# EAGLE design wordclock-r1 (EAGLE 4.16)
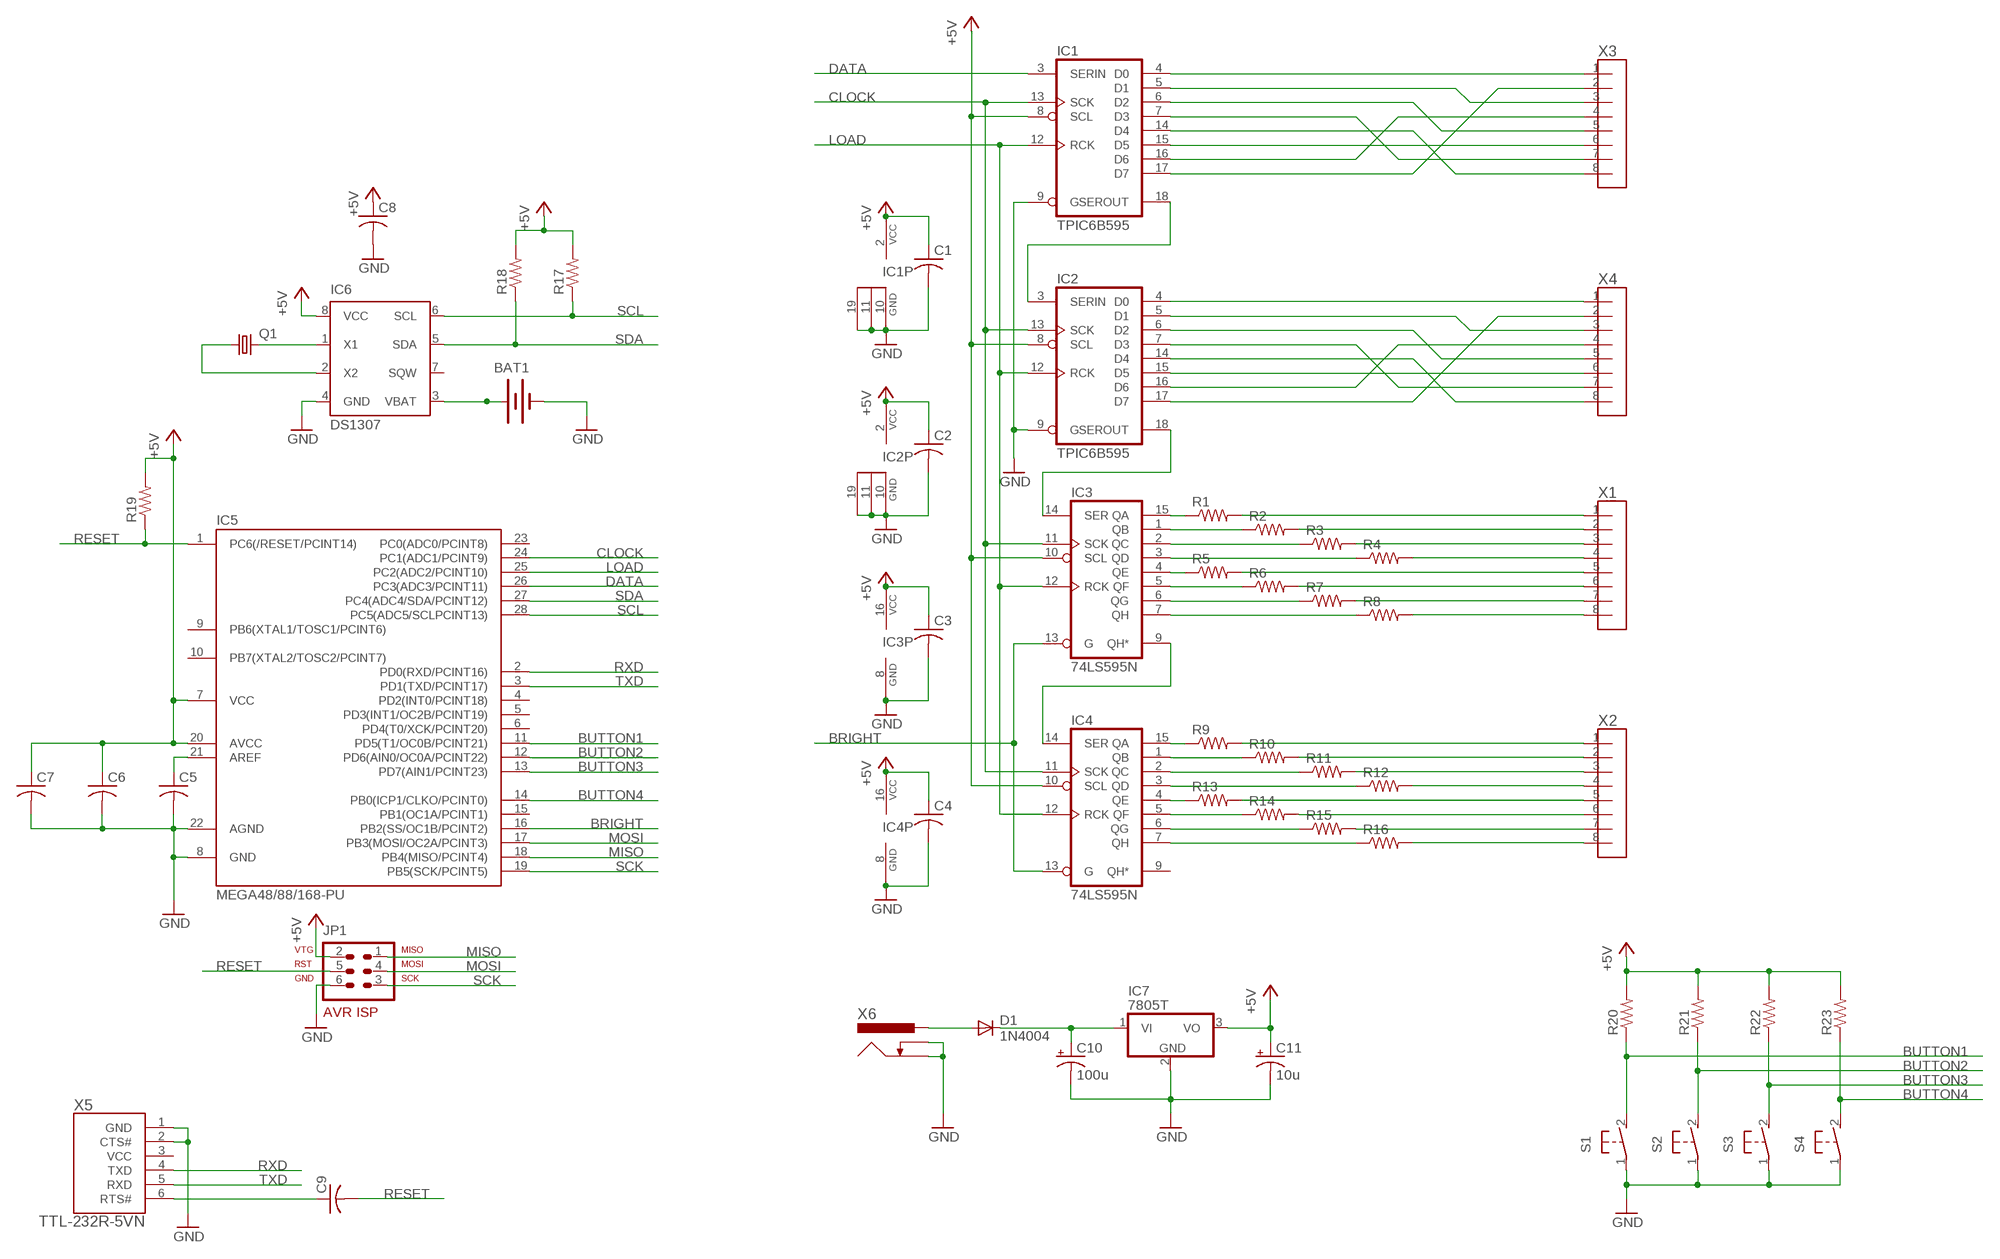
[diagram p0: schematic, sheet 1]

## Parts
BAT1  BATTERY12MM  [BATTCON_12MM]
C1  C-US050-025X075  [C050-025X075]
C2  C-US050-025X075  [C050-025X075]
C3  C-US050-025X075  [C050-025X075]
C4  C-US050-025X075  [C050-025X075]
C5  C-US050-025X075  [C050-025X075]
C6  C-US050-025X075  [C050-025X075]
C7  C-US050-025X075  [C050-025X075]
C8  C-US050-025X075  [C050-025X075]
C9  C-US050-025X075  [C050-025X075]
C10  100u  CPOL-USE3.5-8  [E3,5-8]
C11  10u  CPOL-USE2.5-6  [E2,5-6]
D1  1N4004  [DO41-10]
IC1  TPIC6B595  [DIL20]
IC2  TPIC6B595  [DIL20]
IC3  74LS595N  [DIL16]
IC4  74LS595N  [DIL16]
IC5  MEGA48/88/168-PU  [DIL28-3]
IC6  DS1307  [DIL08]
IC7  7805T  [TO220H]
JP1  AVR-ISP-6  [AVR-ISP-6]
Q1  CRYSTALTC38H  [TC38H]
R1  R-US_0207/2V  [0207/2V]
R2  R-US_0207/2V  [0207/2V]
R3  R-US_0207/2V  [0207/2V]
R4  R-US_0207/2V  [0207/2V]
R5  R-US_0207/2V  [0207/2V]
R6  R-US_0207/2V  [0207/2V]
R7  R-US_0207/2V  [0207/2V]
R8  R-US_0207/2V  [0207/2V]
R9  R-US_0207/2V  [0207/2V]
R10  R-US_0207/2V  [0207/2V]
R11  R-US_0207/2V  [0207/2V]
R12  R-US_0207/2V  [0207/2V]
R13  R-US_0207/2V  [0207/2V]
R14  R-US_0207/2V  [0207/2V]
R15  R-US_0207/2V  [0207/2V]
R16  R-US_0207/2V  [0207/2V]
R17  R-US_0207/10  [0207/10]
R18  R-US_0207/10  [0207/10]
R19  R-US_0207/10  [0207/10]
R20  R-US_0207/10  [0207/10]
R21  R-US_0207/10  [0207/10]
R22  R-US_0207/10  [0207/10]
R23  R-US_0207/10  [0207/10]
S1  31-XX  [B3F-31XX]
S2  31-XX  [B3F-31XX]
S3  31-XX  [B3F-31XX]
S4  31-XX  [B3F-31XX]
X1  M08-100MIL  [100MIL-8]
X2  M08-100MIL  [100MIL-8]
X3  M08-100MIL  [100MIL-8]
X4  M08-100MIL  [100MIL-8]
X5  TTL-232R-5VN  [USBCABLE-0.100-NOLBL]
X6  PJ-002B  [PJ-002]

## Nets
+5V: C1.1 C2.1 C3.1 C4.1 C6.1 C7.1 C8.1 C11.+ IC1.2(VCC) IC1.8(SCL) IC2.2(VCC) IC2.8(SCL) IC3.10(SCL) IC3.16(VCC) IC4.10(SCL) IC4.16(VCC) IC5.7(VCC) IC5.20(AVCC) IC6.8(VCC) IC7.3(VO) JP1.2 R17.2 R18.2 R19.2 R20.2 R21.2 R22.2 R23.2
BRIGHT: IC3.13(G) IC4.13(G) IC5.16(PB2(SS/OC1B/PCINT2))
BUTTON1: IC5.11(PD5(T1/OC0B/PCINT21)) R20.1 S1.2(S)
BUTTON2: IC5.12(PD6(AIN0/OC0A/PCINT22)) R21.1 S2.2(S)
BUTTON3: IC5.13(PD7(AIN1/PCINT23)) R22.1 S3.2(S)
BUTTON4: IC5.14(PB0(ICP1/CLKO/PCINT0)) R23.1 S4.2(S)
CLOCK: IC1.13(SCK) IC2.13(SCK) IC3.11(SCK) IC4.11(SCK) IC5.24(PC1(ADC1/PCINT9))
DATA: IC1.3(SERIN) IC5.26(PC3(ADC3/PCINT11))
GND: BAT1.GND(-) C1.2 C2.2 C3.2 C4.2 C5.2 C6.2 C7.2 C8.2 C10.- C11.- IC1.9(G) IC1.10(GND) IC1.11(GND1) IC1.19(GND2) IC2.9(G) IC2.10(GND) IC2.11(GND1) IC2.19(GND2) IC3.8(GND) IC4.8(GND) IC5.8(GND) IC5.22(AGND) IC6.4(GND) IC7.2(GND) JP1.6 S1.1(P) S2.1(P) S3.1(P) S4.1(P) X5.1(GND) X5.2(CTS#) X6.2 X6.3
LOAD: IC1.12(RCK) IC2.12(RCK) IC3.12(RCK) IC4.12(RCK) IC5.25(PC2(ADC2/PCINT10))
MISO: IC5.18(PB4(MISO/PCINT4)) JP1.1
MOSI: IC5.17(PB3(MOSI/OC2A/PCINT3)) JP1.4
N$1: R16.2 X2.8
N$2: R15.2 X2.7
N$3: R14.2 X2.6
N$4: IC1.18(SEROUT) IC2.3(SERIN)
N$5: IC2.18(SEROUT) IC3.14(SER)
N$6: IC3.9(QH*) IC4.14(SER)
N$7: IC3.15(QA) R1.1
N$8: IC3.1(QB) R2.1
N$9: IC3.2(QC) R3.1
N$10: IC3.3(QD) R4.1
N$11: IC3.4(QE) R5.1
N$12: IC3.5(QF) R6.1
N$13: IC3.6(QG) R7.1
N$14: IC3.7(QH) R8.1
N$15: C9.1 X5.6(RTS#)
N$16: IC4.15(QA) R9.1
N$17: IC4.1(QB) R10.1
N$18: IC4.2(QC) R11.1
N$19: IC4.3(QD) R12.1
N$20: IC4.4(QE) R13.1
N$21: IC4.5(QF) R14.1
N$22: IC4.6(QG) R15.1
N$23: IC4.7(QH) R16.1
N$24: R13.2 X2.5
N$25: R12.2 X2.4
N$26: R11.2 X2.3
N$27: R10.2 X2.2
N$28: R9.2 X2.1
N$29: R1.2 X1.1
N$30: R2.2 X1.2
N$31: R3.2 X1.3
N$32: R4.2 X1.4
N$33: R5.2 X1.5
N$34: R6.2 X1.6
N$35: R7.2 X1.7
N$36: R8.2 X1.8
N$37: IC6.2(X2) Q1.1
N$38: IC1.4(D0) X3.1
N$39: IC1.17(D7) X3.2
N$40: IC1.5(D1) X3.3
N$41: IC1.16(D6) X3.4
N$42: IC1.6(D2) X3.5
N$43: IC1.15(D5) X3.6
N$44: IC1.7(D3) X3.7
N$45: IC1.14(D4) X3.8
N$46: IC2.14(D4) X4.8
N$47: IC2.7(D3) X4.7
N$48: IC2.15(D5) X4.6
N$49: IC2.6(D2) X4.5
N$50: IC2.16(D6) X4.4
N$51: IC2.5(D1) X4.3
N$52: IC2.17(D7) X4.2
N$53: IC2.4(D0) X4.1
N$54: C5.1 IC5.21(AREF)
N$55: IC6.1(X1) Q1.2
N$56: D1.A X6.1
N$57: C10.+ D1.C IC7.1(VI)
N$58: BAT1.PWR@1(+) IC6.3(VBAT)
RESET: C9.2 IC5.1(PC6(/RESET/PCINT14)) JP1.5 R19.1
RXD: IC5.2(PD0(RXD/PCINT16)) X5.4(TXD)
SCK: IC5.19(PB5(SCK/PCINT5)) JP1.3
SCL: IC5.28(PC5(ADC5/SCLPCINT13)) IC6.6(SCL) R17.1
SDA: IC5.27(PC4(ADC4/SDA/PCINT12)) IC6.5(SDA) R18.1
TXD: IC5.3(PD1(TXD/PCINT17)) X5.5(RXD)
Unconnected: IC4.9(QH*) IC5.4(PD2(INT0/PCINT18)) IC5.5(PD3(INT1/OC2B/PCINT19)) IC5.6(PD4(T0/XCK/PCINT20)) IC5.9(PB6(XTAL1/TOSC1/PCINT6)) IC5.10(PB7(XTAL2/TOSC2/PCINT7)) IC5.15(PB1(OC1A/PCINT1)) IC5.23(PC0(ADC0/PCINT8)) IC6.7(SQW) X5.3(VCC)

## Library data of the parts
BAT1 = sfe-sparkfun:BATTERY: Battery Holders Various common sizes : AA, AAA, 20mm coin cell and 12mm coin cell.
C1-C9 = rcl:C-US: CAPACITOR, American symbol
C10 C11 = rcl:CPOL-US: POLARIZED CAPACITOR, American symbol
D1 = diode:1N4004: DIODE general purpose rectifier, 1 A
IC1 IC2 = rbg-ti-powerlogic:TPIC6B595: 8-bit SHIFT REGISTER, output latch, open collector
IC3 IC4 = 74xx-us:74*595: 8-bit SHIFT REGISTER, output latch
IC5 = avr-5-4.16:MEGA48/88/168-PU
IC6 = ds1307_pcf8583:DS1307: I2C-Bus CLOCK/CALENDAR
IC7 = linear:78*: Positive VOLTAGE REGULATOR Source: http://cache.national.com/ds/LM/LM78L05.pdf http://www.fairchildsemi.com/ds/LM/LM7805.pdf
JP1 = avr-5-4.16:AVR-ISP-6: AVR ISP-6 Serial Programming Header
Q1 = crystal:CRYSTAL: CRYSTAL
R1-R23 = rcl:R-US_: RESISTOR, American symbol
S1-S4 = switch-omron:31-XX: OMRON SWITCH
X1-X4 = rbg-generic-headers:M08-100MIL
X5 = rbg-ftdi-usb:TTL-232R-5V
X6 = rbg-cui-dcpower:PJ-002

## Board
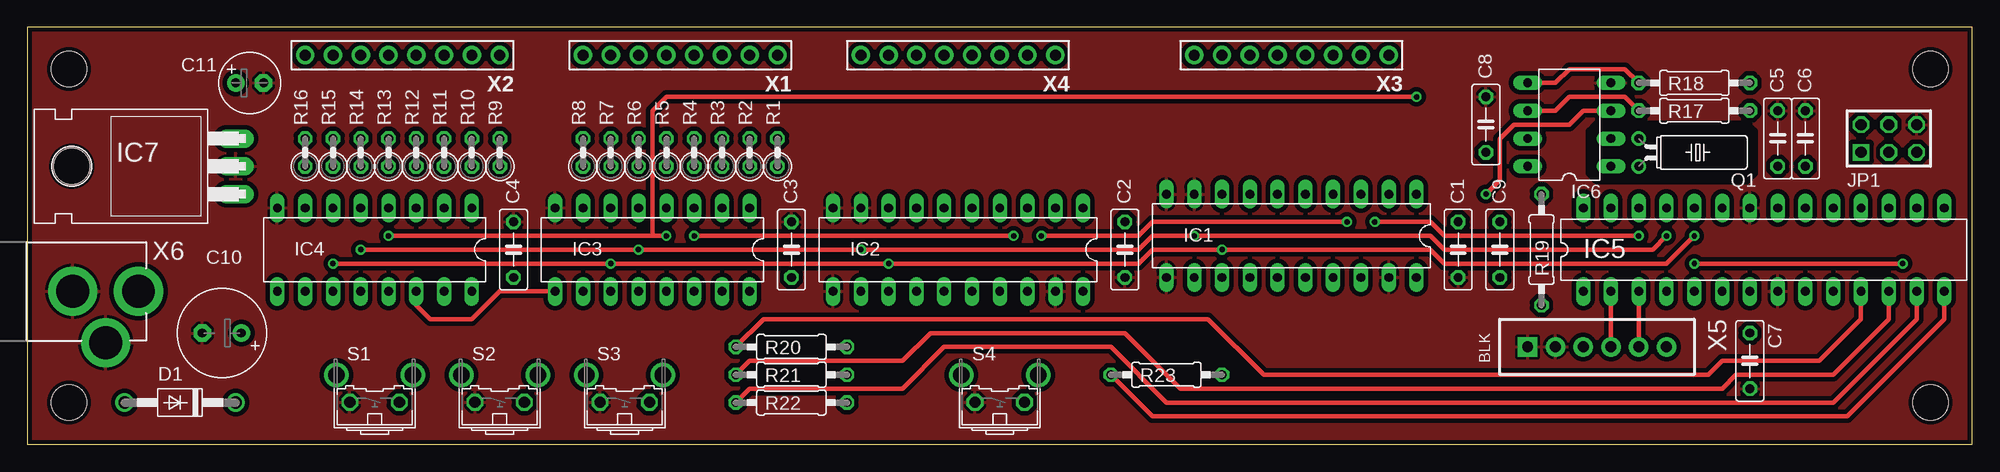
[diagram p1: board, top side]
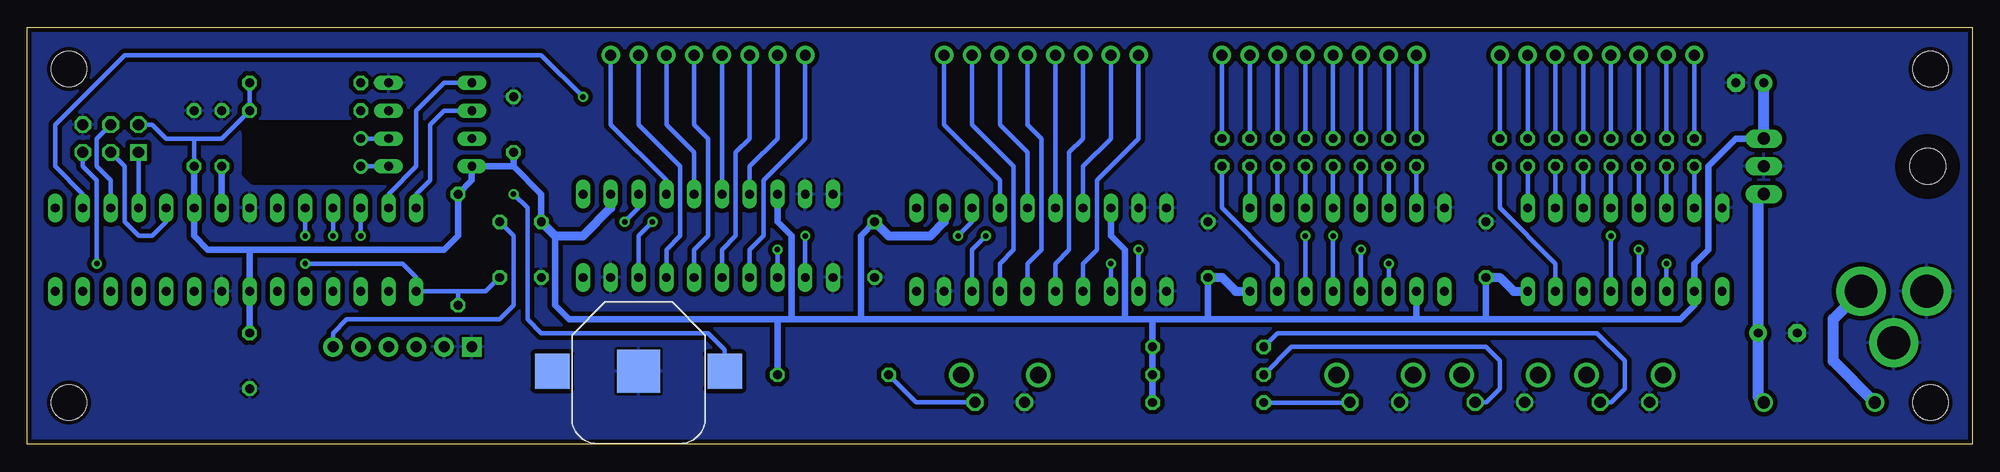
[diagram p2: board, bottom side, seen from below]

Size 177.8 x 38.1 mm. Coordinates in mm from the lower left corner, seen from the top.
Outline: 0,38.1 0,0 177.8,0 177.8,38.1 0,38.1
Copper layers (1*16): Top 0.035mm / dielectric 1.5mm / Bottom 0.035mm
Design rules "default": minimum track width 10mil, minimum drill 19mil, track to track 8mil, track to pad 8mil, pad to pad 8mil, via to via 8mil, smd to smd 8mil, copper to edge 10mil, drill to drill 8mil, minimum pad ring 10mil, minimum via ring 8mil, stop-mask expansion 4mil, vias tented up to drill 0mil, thermal gap 10mil
Holes 3.2 mm at 3.81,34.29 173.99,34.29 173.99,3.81 3.81,3.81
tRestrict: 8 lines
bRestrict: 8 lines

### Footprints (pad centres in the part's own frame; a part is rotated, then mirrored left to right if it is on the bottom)
BATTCON_12MM = smd 3.962 x 3.962: GND 0,0 | smd 3.175 x 3.175: PWR@1 -7.874,0; PWR@2 7.874,0
C050-025X075 = drill 0.813 octagon: 1 -2.54,0; 2 2.54,0
E3,5-8 = drill 0.813 pad 1.6 round: + -1.778,0 | drill 0.813 pad 1.6 octagon: - 1.778,0
E2,5-6 = drill 0.813 pad 1.6 round: + -1.27,0 | drill 0.813 pad 1.6 octagon: - 1.27,0
DO41-10 = drill 1.118 round: A 5.08,0; C -5.08,0
DIL20 = drill 0.813 long: 1 -11.43,-3.81; 2 -8.89,-3.81; 3 -6.35,-3.81; 4 -3.81,-3.81; 5 -1.27,-3.81; 6 1.27,-3.81; 7 3.81,-3.81; 8 6.35,-3.81; 9 8.89,-3.81; 10 11.43,-3.81; 11 11.43,3.81; 12 8.89,3.81; 13 6.35,3.81; 14 3.81,3.81; 15 1.27,3.81; 16 -1.27,3.81; 17 -3.81,3.81; 18 -6.35,3.81; 19 -8.89,3.81; 20 -11.43,3.81
DIL16 = drill 0.813 long: 1 -8.89,-3.81; 2 -6.35,-3.81; 3 -3.81,-3.81; 4 -1.27,-3.81; 5 1.27,-3.81; 6 3.81,-3.81; 7 6.35,-3.81; 8 8.89,-3.81; 9 8.89,3.81; 10 6.35,3.81; 11 3.81,3.81; 12 1.27,3.81; 13 -1.27,3.81; 14 -3.81,3.81; 15 -6.35,3.81; 16 -8.89,3.81
DIL28-3 = drill 0.813 long: 1 -16.51,-3.81; 2 -13.97,-3.81; 3 -11.43,-3.81; 4 -8.89,-3.81; 5 -6.35,-3.81; 6 -3.81,-3.81; 7 -1.27,-3.81; 8 1.27,-3.81; 9 3.81,-3.81; 10 6.35,-3.81; 11 8.89,-3.81; 12 11.43,-3.81; 13 13.97,-3.81; 14 16.51,-3.81; 15 16.51,3.81; 16 13.97,3.81; 17 11.43,3.81; 18 8.89,3.81; 19 6.35,3.81; 20 3.81,3.81; 21 1.27,3.81; 22 -1.27,3.81; 23 -3.81,3.81; 24 -6.35,3.81; 25 -8.89,3.81; 26 -11.43,3.81; 27 -13.97,3.81; 28 -16.51,3.81
DIL08 = drill 0.813 long: 1 -3.81,-3.81; 2 -1.27,-3.81; 3 1.27,-3.81; 4 3.81,-3.81; 5 3.81,3.81; 6 1.27,3.81; 7 -1.27,3.81; 8 -3.81,3.81
TO220H = drill 1.118 long: 1 -2.54,-10.16; 2 0,-10.16; 3 2.54,-10.16 | hole 3.302: 0,4.826
AVR-ISP-6 = drill 1.016 square: 1 -2.54,-1.27 | drill 1.016 octagon: 2 -2.54,1.27; 3 0,-1.27; 4 0,1.27; 5 2.54,-1.27; 6 2.54,1.27
TC38H = drill 0.813 round: 1 -1.27,0; 2 1.27,0
0207/2V = drill 0.813 octagon: 1 -1.27,0; 2 1.27,0
0207/10 = drill 0.813 octagon: 1 -5.08,0; 2 5.08,0
B3F-31XX = drill 1.016 octagon: 1 -2.261,-1.245; 2 2.261,-1.245 | drill 1.499 pad 2.159 round: 3 -3.505,1.245; 4 3.505,1.245
100MIL-8 = drill 1 pad 1.676 round: 1 -8.89,0; 2 -6.35,0; 3 -3.81,0; 4 -1.27,0; 5 1.27,0; 6 3.81,0; 7 6.35,0; 8 8.89,0
USBCABLE-0.100-NOLBL = drill 1 pad 1.778 square: 1 0,-7.62 | drill 1 pad 1.778 round: 2 0,-5.08; 3 0,-2.54; 4 0,0; 5 0,2.54; 6 0,5.08
PJ-002 = drill 3 pad 4.5 round: 1 0,0; 2 0,6; 3 -4.7,3

### Placement (x,y rotation side)
BAT1  121.92,6.67 180 bottom
C1  130.81,17.78 270 top
C2  100.33,17.78 270 top
C3  69.85,17.78 90 top
C4  44.45,17.78 90 top
C5  160.02,27.94 90 top
C6  162.56,27.94 90 top
C7  157.48,7.62 270 top
C8  133.35,29.21 90 top
C9  134.62,17.78 270 top
C10  17.78,10.16 180 top
C11  20.32,33.02 0 top
D1  13.97,3.81 180 top
IC1  115.57,19.05 180 top
IC2  85.09,17.78 180 top
IC3  57.15,17.78 180 top
IC4  31.75,17.78 180 top
IC5  158.75,17.78 0 top
IC6  140.97,29.21 90 top
IC7  8.89,25.4 90 top
JP1  170.18,27.94 0 top
Q1  147.32,26.67 270 top
R1  68.58,26.67 90 top
R2  66.04,26.67 90 top
R3  63.5,26.67 90 top
R4  60.96,26.67 90 top
R5  58.42,26.67 90 top
R6  55.88,26.67 90 top
R7  53.34,26.67 90 top
R8  50.8,26.67 90 top
R9  43.18,26.67 90 top
R10  40.64,26.67 90 top
R11  38.1,26.67 90 top
R12  35.56,26.67 90 top
R13  33.02,26.67 90 top
R14  30.48,26.67 90 top
R15  27.94,26.67 90 top
R16  25.4,26.67 90 top
R17  152.4,30.48 0 top
R18  152.4,33.02 0 top
R19  138.43,17.78 90 top
R20  69.85,8.89 0 top
R21  69.85,6.35 0 top
R22  69.85,3.81 0 top
R23  104.14,6.35 0 top
S1  31.75,5.08 0 top
S2  43.18,5.08 0 top
S3  54.61,5.08 0 top
S4  88.9,5.08 0 top
X1  59.69,35.56 180 top
X2  34.29,35.56 180 top
X3  115.57,35.56 180 top
X4  85.09,35.56 180 top
X5  144.78,8.89 270 top
X6  10.16,13.97 90 top

### Tracks (layer width: path | path; a pad name or v marks a point on that pad's centre or on a via)
+5V
  Bottom 0.406: R18.2 R17.2 160.02,27.94 162.56,27.94 | C6.1 162.56,27.94 | 162.56,27.94 165.1,27.94 166.37,29.21 JP1.2
  Bottom 0.61: 44.45,11.43 26.67,11.43 25.4,12.7 IC4.10 25.4,16.51 24.13,17.78 24.13,25.4 21.59,27.94 IC7.3 | 44.45,11.43 50.8,11.43 | 50.8,11.43 69.85,11.43 | 69.85,11.43 74.93,11.43 | 74.93,11.43 77.47,11.43 | 77.47,11.43 101.6,11.43 | 101.6,11.43 107.95,11.43 | C2.1 101.6,19.05 101.6,11.43 | 69.85,11.43 C3.1 | 44.45,11.43 C4.1 | 50.8,11.43 IC3.10 | IC2.8 78.74,19.05 77.47,17.78 77.47,11.43 | IC1.8 109.22,20.32 107.95,19.05 107.95,11.43 | C7.1 IC5.7 157.48,17.78 | C6.1 IC5.20 162.56,19.05 161.29,17.78 157.48,17.78 | 107.95,11.43 109.22,11.43 | 109.22,11.43 128.27,11.43 129.54,12.7 129.54,19.05 | C1.1 130.81,22.86 133.35,25.4 | 133.35,25.4 IC6.8 137.16,24.13 R19.2 138.43,19.05 139.7,17.78 157.48,17.78 | 133.35,25.4 C8.1 | R22.2 R21.2 R20.2 74.93,11.43 | 109.22,11.43 R23.2
  Bottom 0.813: C4.1 43.18,15.24 41.91,13.97 IC4.16 | C3.1 68.58,15.24 67.31,13.97 IC3.16 | IC2.2 93.98,20.32 95.25,19.05 99.06,19.05 C2.1 | IC1.2 124.46,21.59 127,19.05 129.54,19.05 C1.1
  Bottom 1.016: IC7.3 C11.+
BRIGHT  (via drill 0.5)
  Top 0.406: v33.02,19.05 57.15,19.05 | 57.15,19.05 v58.42,19.05 | v127,31.75 58.42,31.75 57.15,30.48 57.15,19.05
  Bottom 0.406: v58.42,19.05 IC3.13 | IC4.13 v33.02,19.05 | IC5.16 172.72,22.86 175.26,25.4 175.26,29.21 168.91,35.56 130.81,35.56 v127,31.75
BUTTON1
  Top 0.406: IC5.11 167.64,11.43 163.83,7.62 154.94,7.62 153.67,6.35 113.03,6.35 107.95,11.43 67.31,11.43 R20.1
  Bottom 0.406: R20.1 63.5,10.16 34.29,10.16 31.75,7.62 31.75,5.08 32.99,3.84 S1.2
BUTTON2
  Top 0.406: IC5.12 170.18,11.43 165.1,6.35 156.21,6.35 154.94,5.08 105.41,5.08 100.33,10.16 82.55,10.16 80.01,7.62 66.04,7.62 R21.1
  Bottom 0.406: R21.1 62.23,8.89 44.45,8.89 43.18,7.62 43.18,5.08 44.42,3.84 S2.2
BUTTON3
  Top 0.406: IC5.13 172.72,11.43 165.1,3.81 104.14,3.81 99.06,8.89 83.82,8.89 80.01,5.08 66.04,5.08 R22.1
  Bottom 0.406: S3.2 57.12,3.84 57.15,3.81 R22.1
BUTTON4
  Top 0.406: IC5.14 175.26,11.43 166.37,2.54 102.87,2.54 R23.1
  Bottom 0.406: S4.2 96.55,3.84 R23.1
CLOCK  (via drill 0.5)
  Top 0.406: v27.94,16.51 v53.34,16.51 v78.74,16.51 101.6,16.51 102.87,17.78 v109.22,17.78 128.27,17.78 129.54,16.51 149.86,16.51 v152.4,19.05
  Bottom 0.406: IC4.11 v27.94,16.51 | v109.22,17.78 IC1.13 | v53.34,16.51 IC3.11 | v78.74,16.51 IC2.13 | v152.4,19.05 IC5.24
DATA  (via drill 0.5)
  Top 0.406: v123.19,20.32 128.27,20.32 129.54,19.05 v147.32,19.05
  Bottom 0.406: IC1.3 121.92,21.59 v123.19,20.32 | v147.32,19.05 IC5.26
GND
  pour Bottom (isolate 0.406): -1.27,39.37 179.07,39.37 179.07,-1.27 -1.27,-1.27
  pour Top (isolate 0.406): -1.27,39.37 179.07,39.37 179.07,-1.27 -1.27,-1.27
LOAD  (via drill 0.5)
  Top 0.406: v30.48,17.78 v55.88,17.78 v76.2,17.78 101.6,17.78 102.87,19.05 v106.68,19.05 128.27,19.05 129.54,17.78 148.59,17.78 v149.86,19.05
  Bottom 0.406: IC4.12 v30.48,17.78 | v106.68,19.05 IC1.12 | v76.2,17.78 IC2.12 | v55.88,17.78 IC3.12 | v149.86,19.05 IC5.25
MISO
  Bottom 0.406: IC5.18 JP1.1
MOSI
  Bottom 0.406: IC5.17 170.18,24.13 171.45,25.4 171.45,27.94 JP1.4
N$1
  Bottom 0.406: R16.2 X2.8
N$2
  Bottom 0.406: R15.2 X2.7
N$3
  Bottom 0.406: R14.2 X2.6
N$4  (via drill 0.5)
  Top 0.406: v92.71,19.05 101.6,19.05 102.87,20.32 v120.65,20.32
  Bottom 0.406: v120.65,20.32 121.92,19.05 IC1.18 | v92.71,19.05 91.44,20.32 IC2.3
N$5  (via drill 0.5)
  Top 0.406: v60.96,19.05 v90.17,19.05
  Bottom 0.406: IC2.18 91.44,17.78 v90.17,19.05 | IC3.14 v60.96,19.05
N$6
  Top 0.406: IC3.9 43.18,13.97 40.64,11.43 36.83,11.43 35.56,12.7 IC4.14
N$7
  Bottom 0.406: IC3.15 63.5,16.51 68.58,21.59 R1.1
N$8
  Bottom 0.406: IC3.1 R2.1
N$9
  Bottom 0.406: IC3.2 R3.1
N$10
  Bottom 0.406: IC3.3 R4.1
N$11
  Bottom 0.406: IC3.4 R5.1
N$12
  Bottom 0.406: IC3.5 R6.1
N$13
  Bottom 0.406: IC3.6 R7.1
N$14
  Bottom 0.406: IC3.7 R8.1
N$15
  Bottom 0.406: C9.1 133.35,19.05 133.35,12.7 134.62,11.43 148.59,11.43 149.86,10.16 X5.6
N$16
  Bottom 0.406: IC4.15 38.1,16.51 43.18,21.59 R9.1
N$17
  Bottom 0.406: IC4.1 R10.1
N$18
  Bottom 0.406: IC4.2 R11.1
N$19
  Bottom 0.406: IC4.3 R12.1
N$20
  Bottom 0.406: IC4.4 R13.1
N$21
  Bottom 0.406: IC4.5 R14.1
N$22
  Bottom 0.406: IC4.6 R15.1
N$23
  Bottom 0.406: IC4.7 R16.1
N$24
  Bottom 0.406: R13.2 X2.5
N$25
  Bottom 0.406: R12.2 X2.4
N$26
  Bottom 0.406: R11.2 X2.3
N$27
  Bottom 0.406: R10.2 X2.2
N$28
  Bottom 0.406: R9.2 X2.1
N$29
  Bottom 0.406: R1.2 X1.1
N$30
  Bottom 0.406: R2.2 X1.2
N$31
  Bottom 0.406: R3.2 X1.3
N$32
  Bottom 0.406: R4.2 X1.4
N$33
  Bottom 0.406: R5.2 X1.5
N$34
  Bottom 0.406: R6.2 X1.6
N$35
  Bottom 0.406: R7.2 X1.7
N$36
  Bottom 0.406: R8.2 X1.8
N$37
  Bottom 0.406: IC6.2 Q1.1
N$38
  Bottom 0.406: IC1.4 119.38,24.13 124.46,29.21 X3.1
N$39
  Bottom 0.406: IC1.17 119.38,17.78 118.11,19.05 118.11,25.4 121.92,29.21 X3.2
N$40
  Bottom 0.406: IC1.5 116.84,26.67 119.38,29.21 X3.3
N$41
  Bottom 0.406: IC1.16 116.84,17.78 115.57,19.05 115.57,27.94 116.84,29.21 X3.4
N$42
  Bottom 0.406: IC1.6 X3.5
N$43
  Bottom 0.406: X3.6 111.76,27.94 113.03,26.67 113.03,19.05 114.3,17.78 IC1.15
N$44
  Bottom 0.406: IC1.7 111.76,25.4 109.22,27.94 X3.7
N$45
  Bottom 0.406: IC1.14 111.76,17.78 110.49,19.05 110.49,24.13 106.68,27.94 X3.8
N$46
  Bottom 0.406: IC2.14 81.28,16.51 80.01,17.78 80.01,24.13 76.2,27.94 X4.8
N$47
  Bottom 0.406: IC2.7 81.28,25.4 78.74,27.94 X4.7
N$48
  Bottom 0.406: IC2.15 83.82,16.51 82.55,17.78 82.55,26.67 81.28,27.94 X4.6
N$49
  Bottom 0.406: IC2.6 X4.5
N$50
  Bottom 0.406: IC2.16 86.36,16.51 85.09,17.78 85.09,27.94 86.36,29.21 X4.4
N$51
  Bottom 0.406: IC2.5 86.36,26.67 88.9,29.21 X4.3
N$52
  Bottom 0.406: IC2.17 88.9,16.51 87.63,17.78 87.63,25.4 91.44,29.21 X4.2
N$53
  Bottom 0.406: IC2.4 88.9,24.13 93.98,29.21 X4.1
N$54
  Bottom 0.61: IC5.21 C5.1
N$55
  Bottom 0.406: IC6.1 Q1.2
N$56
  Bottom 1.016: X6.1 12.7,11.43 12.7,7.62 D1.A
N$57
  Bottom 1.016: D1.C 19.56,4.32 C10.+ 19.56,22.35 IC7.1
N$58  (via drill 0.5)
  Top 0.406: v133.35,22.86 134.62,24.13 134.62,27.94 135.89,29.21 140.97,29.21 142.24,30.48 IC6.3
  Bottom 0.406: BAT1.PWR@1 114.05,8.64 115.57,10.16 130.81,10.16 132.08,11.43 132.08,21.59 v133.35,22.86
RESET  (via drill 0.5)
  Top 0.406: v152.4,16.51 v171.45,16.51
  Bottom 0.406: 138.43,13.97 IC5.1 142.24,15.24 143.51,16.51 v152.4,16.51 | 138.43,13.97 R19.1 | v171.45,16.51 171.45,24.13 172.72,25.4 JP1.5 | C9.2 135.89,13.97 138.43,13.97
RXD
  Top 0.406: X5.4 IC5.2
SCK
  Bottom 0.406: JP1.3 168.91,25.4 168.91,20.32 167.64,19.05 166.37,19.05 165.1,20.32 IC5.19
SCL
  Top 0.406: R17.1 146.05,31.75 140.97,31.75 139.7,30.48 IC6.6
  Bottom 0.406: IC5.28 142.24,22.86 140.97,24.13 140.97,29.21 139.7,30.48 IC6.6
SDA
  Top 0.406: R18.1 146.05,34.29 140.97,34.29 139.7,33.02 IC6.5
  Bottom 0.406: IC5.27 144.78,22.86 142.24,25.4 142.24,30.48 139.7,33.02 IC6.5
TXD
  Top 0.406: X5.5 IC5.3